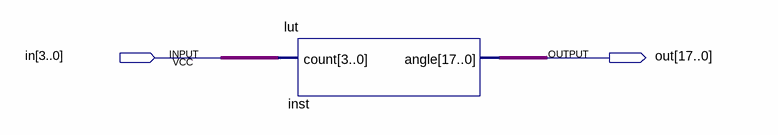
[diagram p0: schematic sheet]
// Quartus schematic lut_test.bdf as structural Verilog: 1 symbols, 2 pins
module lut_test (
  input  [3:0] in,
  output [17:0] out
);

  lut inst (.count(in), .angle(out));
endmodule
